# Altium schematic sheet protocoles de comm.SchDoc: Protocole de communication
size A4; DrawnBy: TAHIRI Manelle; Revision: V1.0 REVA; SheetNumber: 2; SheetTotal: 5
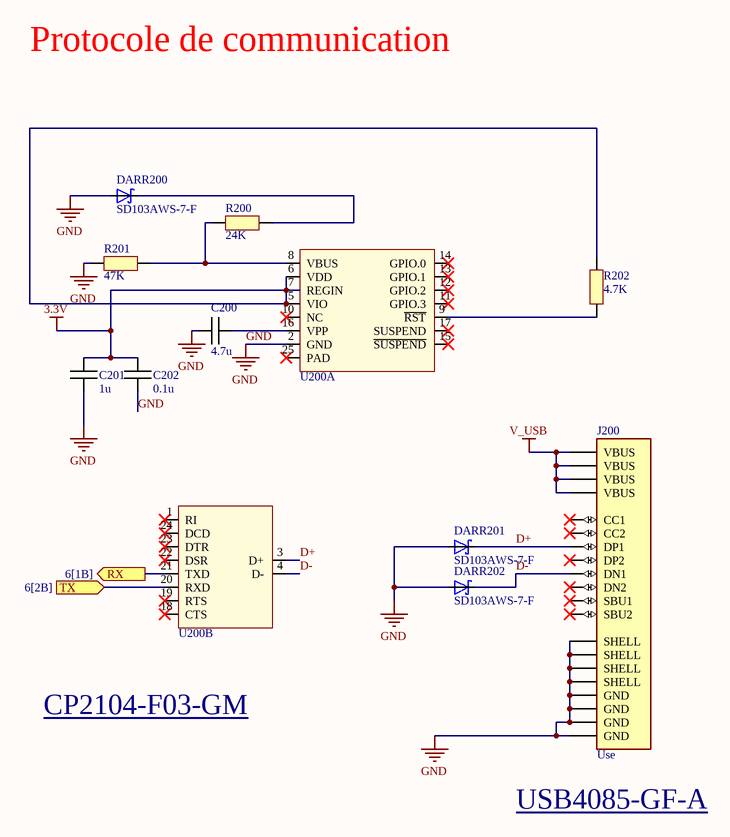
[diagram p0: protocoles de comm.SchDoc]

## Parts
C200  4.7u  [CAPC1005X06N]
C201  1u  [CAPC1005X06N]
C202  0.1u  [CAPC1005X06N]
DARR200  SD103AWS-7-F  [SD103AWS-7-F]
DARR201  SD103AWS-7-F  [SD103AWS-7-F]
DARR202  SD103AWS-7-F  [SD103AWS-7-F]
J200  Use  [USB4085-GF-A]
R200  24K  [RESC1005X06N]
R201  47K  [RESC1005X06N]
R202  4.7K  [RESC1005X06N]
U200  CP2104-F03-GM  [PQFN50P400X400X80_HS-25N]  (value not drawn)  (parts A,B of 2)

## Ports
RX (out, see 6[1B]), TX (in, see 6[2B])

## Nets
3.3V: C201.2 C202.2 R202.2 U200.5(VIO) U200.6(VDD) U200.7(REGIN)
GND: C200.1 C201.1 C202.1 DARR200.2(A) DARR201.2(A) DARR202.2(A) J200.A1(GND) J200.A12(GND) J200.B1(GND) J200.B12(GND) J200.S1(SHELL) J200.S2(SHELL) J200.S3(SHELL) J200.S4(SHELL) R201.1 U200.2(GND)
V_USB: J200.A4(VBUS) J200.A9(VBUS) J200.B4(VBUS) J200.B9(VBUS)
D+: DARR201.1(C) J200.A6(DP1) U200.3(D+)
D-: DARR202.1(C) J200.A7(DN1) U200.4(D-)
RX: U200.21(TXD) ; port RX
TX: U200.20(RXD) ; port TX
NetC200_2: C200.2 U200.16(VPP)
NetDARR200_1: DARR200.1(C) R200.2
NetR200_1: R200.1 R201.2 U200.8(VBUS)
NetR202_1: R202.1 U200.9(~{RST})

Not connected (* = marked no-connect by the designer): J200 A5(CC1)* A8(SBU1)* B5(CC2)* B6(DP2)* B7(DN2)* B8(SBU2)*; U200 1(RI)* 10(NC)* 11(GPIO.3)* 12(GPIO.2)* 13(GPIO.1)* 14(GPIO.0)* 15(~{SUSPEND})* 17(SUSPEND)* 18(CTS)* 19(RTS)* 22(DSR)* 23(DTR)* 24(DCD)* 25(PAD)*

## Notes on the sheet
- Protocole de communication
- CP2104-F03-GM <https://www.mouser.fr/datasheet/2/368/cp2104-1397921.pdf>
- (near J200) USB4085-GF-A <https://www.mouser.fr/datasheet/2/837/GCT_usb4085-3240028.pdf>

## Library data of the parts
C200-C202 = Capacitor
DARR200-DARR202 = SD103AWS-7-F: Diode Array 3 Independent Schottky 40V 175mA Surface Mount 6-TSSOP, SC-88, SOT-363
J200 = USB4085-GF-A: Connecteurs USB USB Type C, 2.0, Rec, TH , G/F, RA , Top Mnt, T & R
R200-R202 = Resistor
U200 = USBBridge: USB Bridge, USB to UART USB 2.0 UART Interface 24-QFN (4x4); Manufacturer 1: Silicon Labs; Supplier 1: Arrow Electronics; Supplier Part Number 1: CP2104-F03-GM; Manufacturer Part Number 1: CP2104-F03-GM